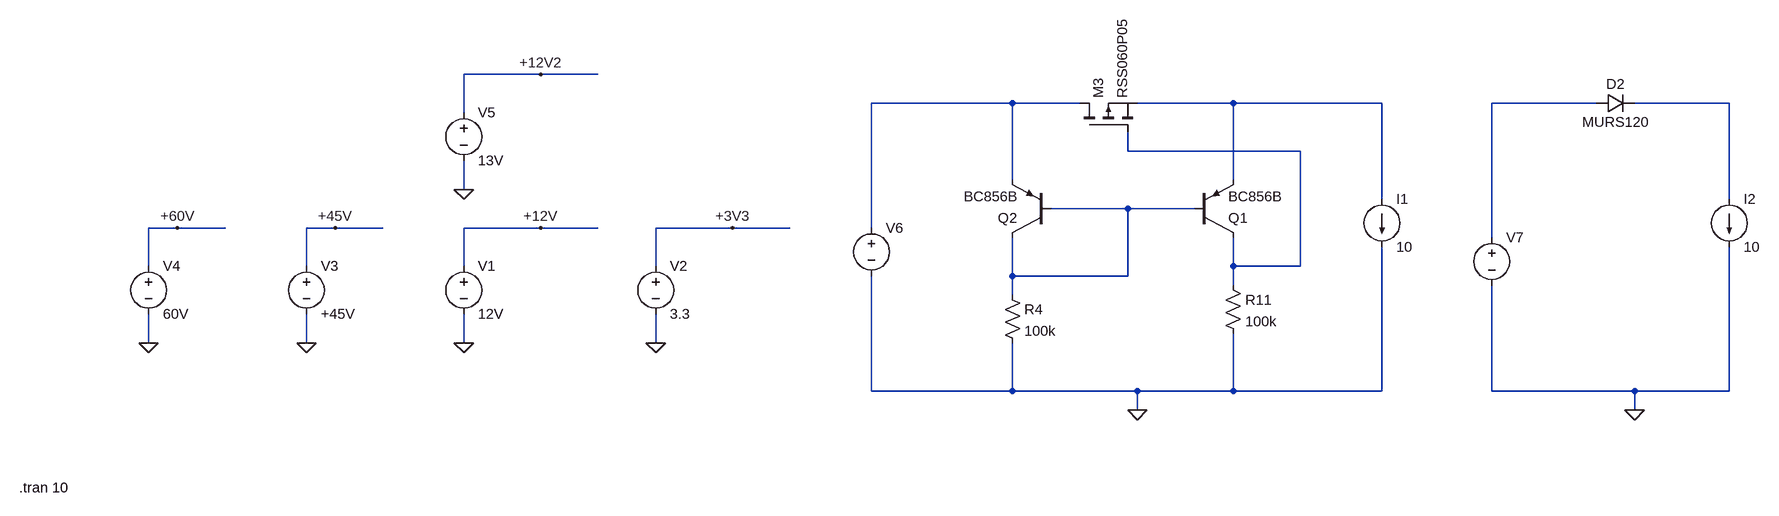
[diagram p0: schematic IDEAL_DIODE.asc]
IDEAL_DIODE.asc, the LTspice schematic file:
Version 4.1
SHEET 1 8196 2708
WIRE 1936 32 1808 32
WIRE 2032 32 1936 32
WIRE 3296 80 2976 80
WIRE 3408 80 3296 80
WIRE 3664 80 3504 80
WIRE 4032 80 3664 80
WIRE 5024 80 4560 80
WIRE 5616 80 5088 80
WIRE 1808 96 1808 32
WIRE 3488 160 3488 128
WIRE 3776 160 3488 160
WIRE 3296 208 3296 80
WIRE 3664 208 3664 80
WIRE 1808 224 1808 176
WIRE 4032 240 4032 80
WIRE 5616 240 5616 80
WIRE 3488 256 3360 256
WIRE 3600 256 3488 256
WIRE 1264 288 1216 288
WIRE 1344 288 1264 288
WIRE 1552 288 1504 288
WIRE 1632 288 1552 288
WIRE 1936 288 1808 288
WIRE 2032 288 1936 288
WIRE 2256 288 2128 288
WIRE 2352 288 2256 288
WIRE 2976 288 2976 80
WIRE 4560 304 4560 80
WIRE 1216 352 1216 288
WIRE 1504 352 1504 288
WIRE 1808 352 1808 288
WIRE 2128 352 2128 288
WIRE 3664 352 3664 304
WIRE 3776 352 3776 160
WIRE 3776 352 3664 352
WIRE 3296 368 3296 304
WIRE 3488 368 3488 256
WIRE 3488 368 3296 368
WIRE 3664 384 3664 352
WIRE 3296 400 3296 368
WIRE 1216 480 1216 432
WIRE 1504 480 1504 432
WIRE 1808 480 1808 432
WIRE 2128 480 2128 432
WIRE 2976 560 2976 368
WIRE 3296 560 3296 480
WIRE 3296 560 2976 560
WIRE 3504 560 3296 560
WIRE 3664 560 3664 464
WIRE 3664 560 3504 560
WIRE 4032 560 4032 320
WIRE 4032 560 3664 560
WIRE 4560 560 4560 384
WIRE 5088 560 4560 560
WIRE 5616 560 5616 320
WIRE 5616 560 5088 560
WIRE 3504 592 3504 560
WIRE 5088 592 5088 560
FLAG 1808 480 0
FLAG 1936 288 +12V
FLAG 2128 480 0
FLAG 2256 288 +3V3
FLAG 1504 480 0
FLAG 1552 288 +45V
FLAG 1216 480 0
FLAG 1264 288 +60V
FLAG 1808 224 0
FLAG 1936 32 +12V2
FLAG 3504 592 0
FLAG 5088 592 0
SYMBOL voltage 1808 336 R0
WINDOW 123 0 0 Left 0
WINDOW 39 0 0 Left 0
SYMATTR InstName V1
SYMATTR Value 12V
SYMBOL voltage 2128 336 R0
WINDOW 123 0 0 Left 0
WINDOW 39 0 0 Left 0
SYMATTR InstName V2
SYMATTR Value 3.3
SYMBOL voltage 1504 336 R0
WINDOW 123 0 0 Left 0
WINDOW 39 0 0 Left 0
SYMATTR InstName V3
SYMATTR Value +45V
SYMBOL voltage 1216 336 R0
WINDOW 123 0 0 Left 0
WINDOW 39 0 0 Left 0
SYMATTR InstName V4
SYMATTR Value 60V
SYMBOL voltage 1808 80 R0
WINDOW 123 0 0 Left 0
WINDOW 39 0 0 Left 0
SYMATTR InstName V5
SYMATTR Value 13V
SYMBOL voltage 2976 272 R0
WINDOW 3 24 96 Invisible 2
WINDOW 123 0 0 Left 0
WINDOW 39 0 0 Left 0
SYMATTR Value PWL(0 1 1 2 2 3 3 4 4 5 5 6 6 7 7 8 8 9 9 10 10 11)
SYMATTR InstName V6
SYMBOL pmos 3408 128 R270
SYMATTR InstName M3
SYMATTR Value RSS060P05
SYMBOL pnp 3600 304 M180
SYMATTR InstName Q1
SYMATTR Value BC856B
SYMBOL pnp 3360 304 R180
SYMATTR InstName Q2
SYMATTR Value BC856B
SYMBOL res 3280 384 R0
SYMATTR InstName R4
SYMATTR Value 100k
SYMBOL res 3648 368 R0
SYMATTR InstName R11
SYMATTR Value 100k
SYMBOL diode 5024 96 R270
WINDOW 0 32 32 VTop 2
WINDOW 3 0 32 VBottom 2
SYMATTR InstName D2
SYMATTR Value MURS120
SYMBOL voltage 4560 288 R0
WINDOW 3 24 96 Invisible 2
WINDOW 123 0 0 Left 0
WINDOW 39 0 0 Left 0
SYMATTR Value PWL(0 1 1 2 2 3 3 4 4 5 5 6 6 7 7 8 8 9 9 10 10 11)
SYMATTR InstName V7
SYMBOL load2 4032 240 R0
WINDOW 123 0 0 Left 0
WINDOW 39 0 0 Left 0
SYMATTR InstName I1
SYMATTR Value 10
SYMBOL load2 5616 240 R0
WINDOW 123 0 0 Left 0
WINDOW 39 0 0 Left 0
SYMATTR InstName I2
SYMATTR Value 10
TEXT -1360 1528 Left 2 !.tran 10

The netlist it stands for:
* IDEAL_DIODE.asc
V1 +12V 0 12V
V2 +3V3 0 3.3
V3 +45V 0 +45V
V4 +60V 0 60V
V5 +12V2 0 13V
V6 N001 0 PWL(0 1 1 2 2 3 3 4 4 5 5 6 6 7 7 8 8 9 9 10 10 11)
M3 N001 N005 N002 N002 RSS060P05
Q1 N005 N006 N002 0 BC856B
Q2 N006 N006 N001 0 BC856B
R4 N006 0 100k
R11 N005 0 100k
D2 N003 N004 MURS120
V7 N003 0 PWL(0 1 1 2 2 3 3 4 4 5 5 6 6 7 7 8 8 9 9 10 10 11)
I1 N002 0 10
I2 N004 0 10
.model D D
.lib standard.dio
.model NPN NPN
.model PNP PNP
.lib standard.bjt
.model NMOS NMOS
.model PMOS PMOS
.lib standard.mos
.tran 10
.backanno
.end